# EAGLE schematic CPU_v1_0 (EAGLE 9.6.2)
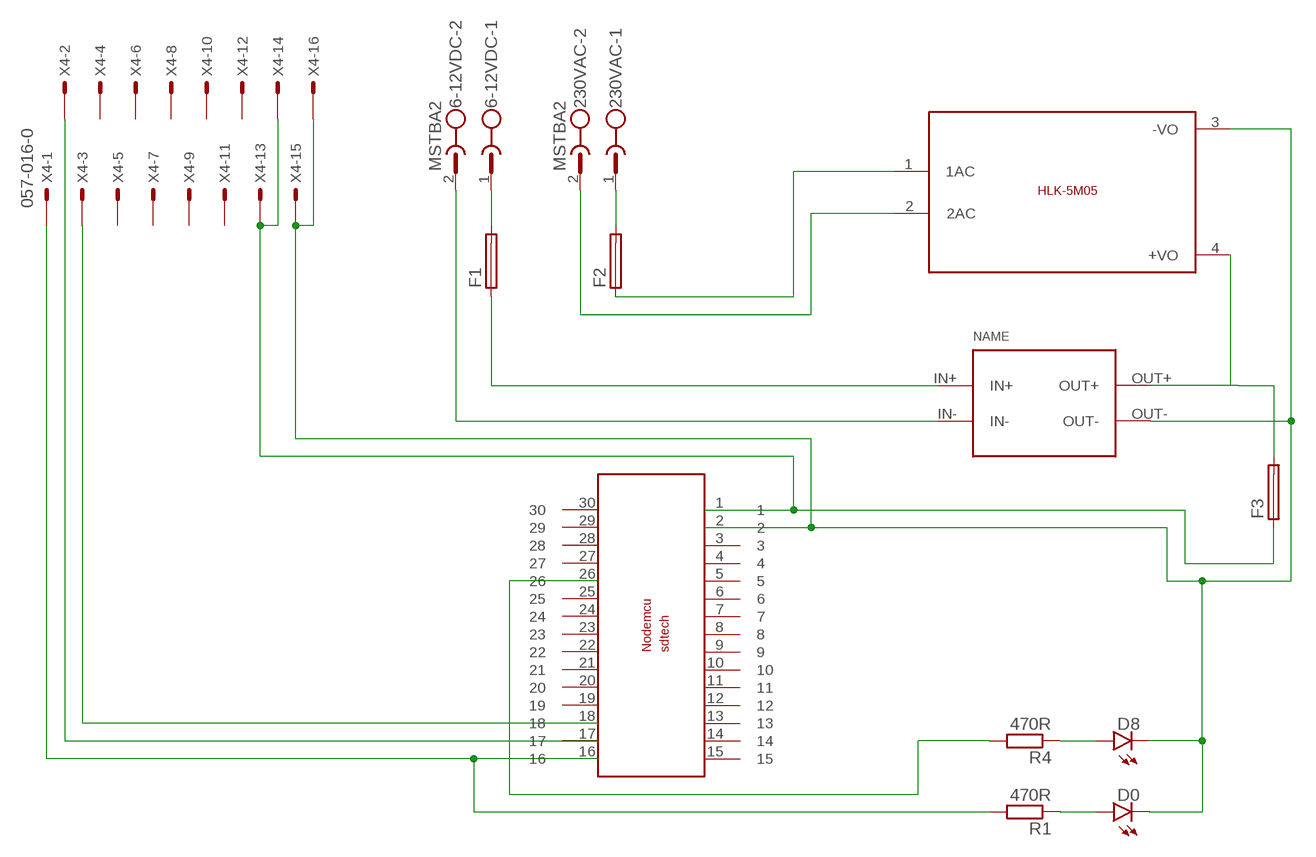
[diagram p0: schematic, sheet 1]

## Parts
6-12VDC  MSTBA2  [MSTBA2]
230VAC  MSTBA2  [MSTBA2]
D0  LED3MM  [LED3MM]
D8  LED3MM  [LED3MM]
F1  SH22,5A  [SH22,5A]
F2  SH22,5A  [SH22,5A]
F3  SH22,5A  [SH22,5A]
R1  470R  R-EU_0309/10  [0309/10]
R4  470R  R-EU_0309/10  [0309/10]
U$1  NODEMCUESP8266  [NODEMCUESP8266]
U$2  CP8-ADJ  [CP8-ADJ]
U$3  5VDC/5W  HLK-5M05  [HLK-5M05]
X4  057-016-0  [057-016-0]

## Nets
+5VDC: F3.1 U$1.1 X4.13 X4.14
D0: R1.2 U$1.16 X4.1
D8: R4.2 U$1.26
GND: D0.K(C) D8.K(C) U$1.2 U$2.OUT- U$3.3(-VO) X4.15 X4.16
N$1: D8.A R4.1
N$2: F3.2 U$2.OUT+ U$3.4(+VO)
N$4: D0.A R1.1
N$5: 230VAC.1 F2.2
N$6: F2.1 U$3.1(1AC)
N$7: 230VAC.2 U$3.2(2AC)
N$8: 6-12VDC.1 F1.2
N$9: F1.1 U$2.IN+
N$10: 6-12VDC.2 U$2.IN-
SCL: U$1.17 X4.2
SDA: U$1.18 X4.3
Unconnected: U$1.3 U$1.4 U$1.5 U$1.6 U$1.7 U$1.8 U$1.9 U$1.10 U$1.11 U$1.12 U$1.13 U$1.14 U$1.15 U$1.19 U$1.20 U$1.21 U$1.22 U$1.23 U$1.24 U$1.25 U$1.27 U$1.28 U$1.29 U$1.30 X4.4 X4.5 X4.6 X4.7 X4.8 X4.9 X4.10 X4.11 X4.12

## Library data of the parts
6-12VDC 230VAC = con-phoenix-508:MSTBA2: PHOENIX; MF: FARNELL; MPN: 1757242; OC_FARNELL: 3705171; OC_NEWARK: 71C4161
D0 D8 = led:LED: LED OSRAM: - CHIPLED LG R971, LG N971, LY N971, LG Q971, LY Q971, LO R971, LY R971 LH N974, LH R974 LS Q976, LO Q976, LY Q976 LO Q996 - Hyper CHIPLED LW Q18S LB Q993, LB Q99A, LB R99A - SideLED LS A670, LO A670, LY A670, LG A670, LP A670 LB A673, LV A673, LT A673, LW A673 LH A674 LY A675 LS A676, LA A676, LO A676, LY A676, LW A676 LS A679, LY A679, LG A679 - Hyper Micro SIDELED® LS Y876, LA Y876, LO Y876, LY Y876 LT Y87S - SmartLED LW L88C, LW L88S LB L89C, LB L89S, LG L890 LS L89K, LO L89K, LY L89K LS L896, LA L896, LO L896, LY L896 - TOPLED LS T670, LO T670, LY T670, LG T670, LP T670 LSG T670, LSP T670, LSY T670, LOP T670, LYG T670 LG T671, LOG T671, LSG T671 LB T673, LV T673, LT T673, LW T673 LH T674 LS T676, LA T676, LO T676, LY T676, LB T676, LH T676, LSB T676, LW T676 LB T67C, LV T67C, LT T67C, LS T67K, LO T67K, LY T67K, LW E67C LS E67B, LA E67B, LO E67B, LY E67B, LB E67C, LV E67C, LT E67C LW T67C LS T679, LY T679, LG T679 LS T770, LO T770, LY T770, LG T770, LP T770 LB T773, LV T773, LT T773, LW T773 LH T774 LS E675, LA E675, LY E675, LS T675 LS T776, LA T776, LO T776, LY T776, LB T776 LHGB T686 LT T68C, LB T68C - Hyper Mini TOPLED® LB M676 - Mini TOPLED Santana® LG M470 LS M47K, LO M47K, LY M47K Source: http://www.osram.convergy.de LUXEON: - LUMILED® LXK2-PW12-R00, LXK2-PW12-S00, LXK2-PW14-U00, LXK2-PW14-V00 LXK2-PM12-R00, LXK2-PM12-S00, LXK2-PM14-U00 LXK2-PE12-Q00, LXK2-PE12-R00, LXK2-PE12-S00, LXK2-PE14-T00, LXK2-PE14-U00 LXK2-PB12-K00, LXK2-PB12-L00, LXK2-PB12-M00, LXK2-PB14-N00, LXK2-PB14-P00, LXK2-PB14-Q00 LXK2-PR12-L00, LXK2-PR12-M00, LXK2-PR14-Q00, LXK2-PR14-R00 LXK2-PD12-Q00, LXK2-PD12-R00, LXK2-PD12-S00 LXK2-PH12-R00, LXK2-PH12-S00 LXK2-PL12-P00, LXK2-PL12-Q00, LXK2-PL12-R00 Source: www.luxeon.com KINGBRIGHT: KA-3528ASYC Source: www.kingbright.com
F1-F3 = fuse:SH22,5A: FUSE HOLDER grid 22,5mm, isolated cap OGN0031 8201, Schurter (Buerklin); MPN: 0031.7701.11; OC_FARNELL: unknown; OC_NEWARK: 04F1224
R1 R4 = resistor:R-EU_: RESISTOR, European symbol
U$1 = nodemcu:NODEMCUESP8266: Node Mcu esp8266 12E LIBRARY BY SDTECH ROBOTICS (Shubham Devkar Technology Solutions)
U$2 = userlib:CP8-ADJ: Voltage regulator IN: 7-35V OUT: ADJ
U$3 = HLK-5M05:HLK-5M05: HLK-5M05 is an 5Volt/5W smps developed by HI-LINK; SIZE: 23x38(mm)
X4 = con-panduit:057-016-: CONNECTOR 10-pin series 057 contact pc board low profile headers; OC_FARNELL: unknown; OC_NEWARK: unknown